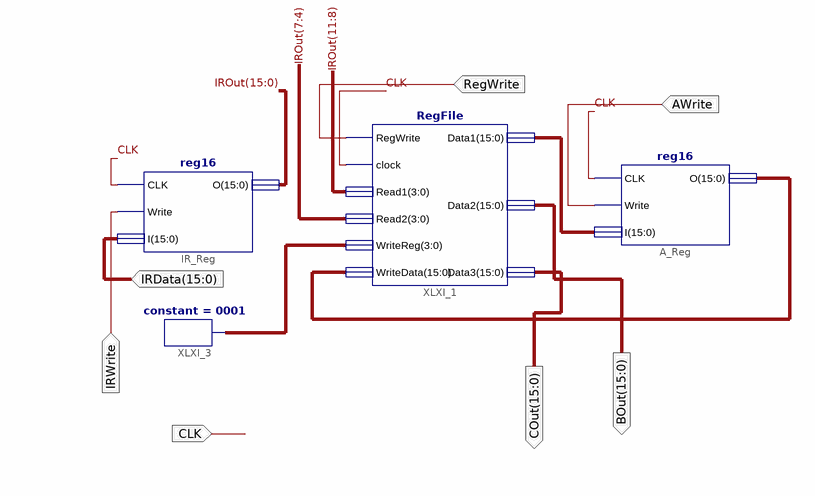
[diagram p0: schematic sheet 1]
// Xilinx ISE schematic sacc.sch (spartan3adsp) as structural Verilog: 4 symbols, 7 ports
module sacc (
  input  CLK,
  input  IRWrite,
  input  [15:0] IRData,
  input  RegWrite,
  input  AWrite,
  output [15:0] BOut,
  output [15:0] COut
);

  wire [3:0] XLXN_10;
  wire [15:0] IROut, XLXN_7, XLXN_8;

  reg16 IR_Reg (.CLK(CLK), .Write(IRWrite), .I(IRData), .O(IROut));
  RegFile XLXI_1 (
    .RegWrite(RegWrite), .clock(CLK), .Read1(IROut[11:8]), .Read2(IROut[7:4]), .WriteReg(XLXN_10),
    .WriteData(XLXN_8), .Data1(XLXN_7), .Data2(BOut), .Data3(COut));
  reg16 A_Reg (.CLK(CLK), .Write(AWrite), .I(XLXN_7), .O(XLXN_8));
  constant #(.CValue("0001")) XLXI_3 (.O(XLXN_10));
endmodule
